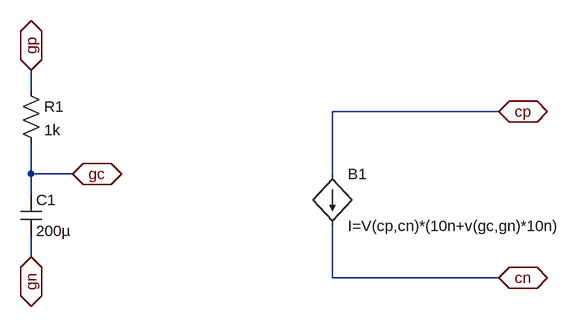
[diagram p0: schematic capteur_de_gaz_LTSpice.asc]
capteur_de_gaz_LTSpice.asc, the LTspice schematic file:
Version 4
SHEET 1 996 680
WIRE 128 64 128 32
WIRE 848 96 592 96
WIRE 128 192 128 144
WIRE 192 192 128 192
WIRE 592 192 592 96
WIRE 128 224 128 192
WIRE 128 320 128 288
WIRE 592 352 592 272
WIRE 848 352 592 352
FLAG 128 32 gp
IOPIN 128 32 BiDir
FLAG 128 320 gn
IOPIN 128 320 BiDir
FLAG 192 192 gc
IOPIN 192 192 BiDir
FLAG 848 352 cn
IOPIN 848 352 BiDir
FLAG 848 96 cp
IOPIN 848 96 BiDir
SYMBOL res 112 48 R0
SYMATTR InstName R1
SYMATTR Value 1k
SYMBOL cap 112 224 R0
SYMATTR InstName C1
SYMATTR Value 200µ
SYMBOL bi 592 192 R0
SYMATTR InstName B1
SYMATTR Value I=V(cp,cn)*(10n+v(gc,gn)*10n)

The netlist it stands for:
* capteur_de_gaz_LTSpice.asc
R1 gp gc 1k
C1 gc gn 200µ
B1 cp cn I=V(cp,cn)*(10n+v(gc,gn)*10n)
.backanno
.end